# EAGLE design P08R6 (EAGLE 9.6.1)

## Sheet 1 of 2
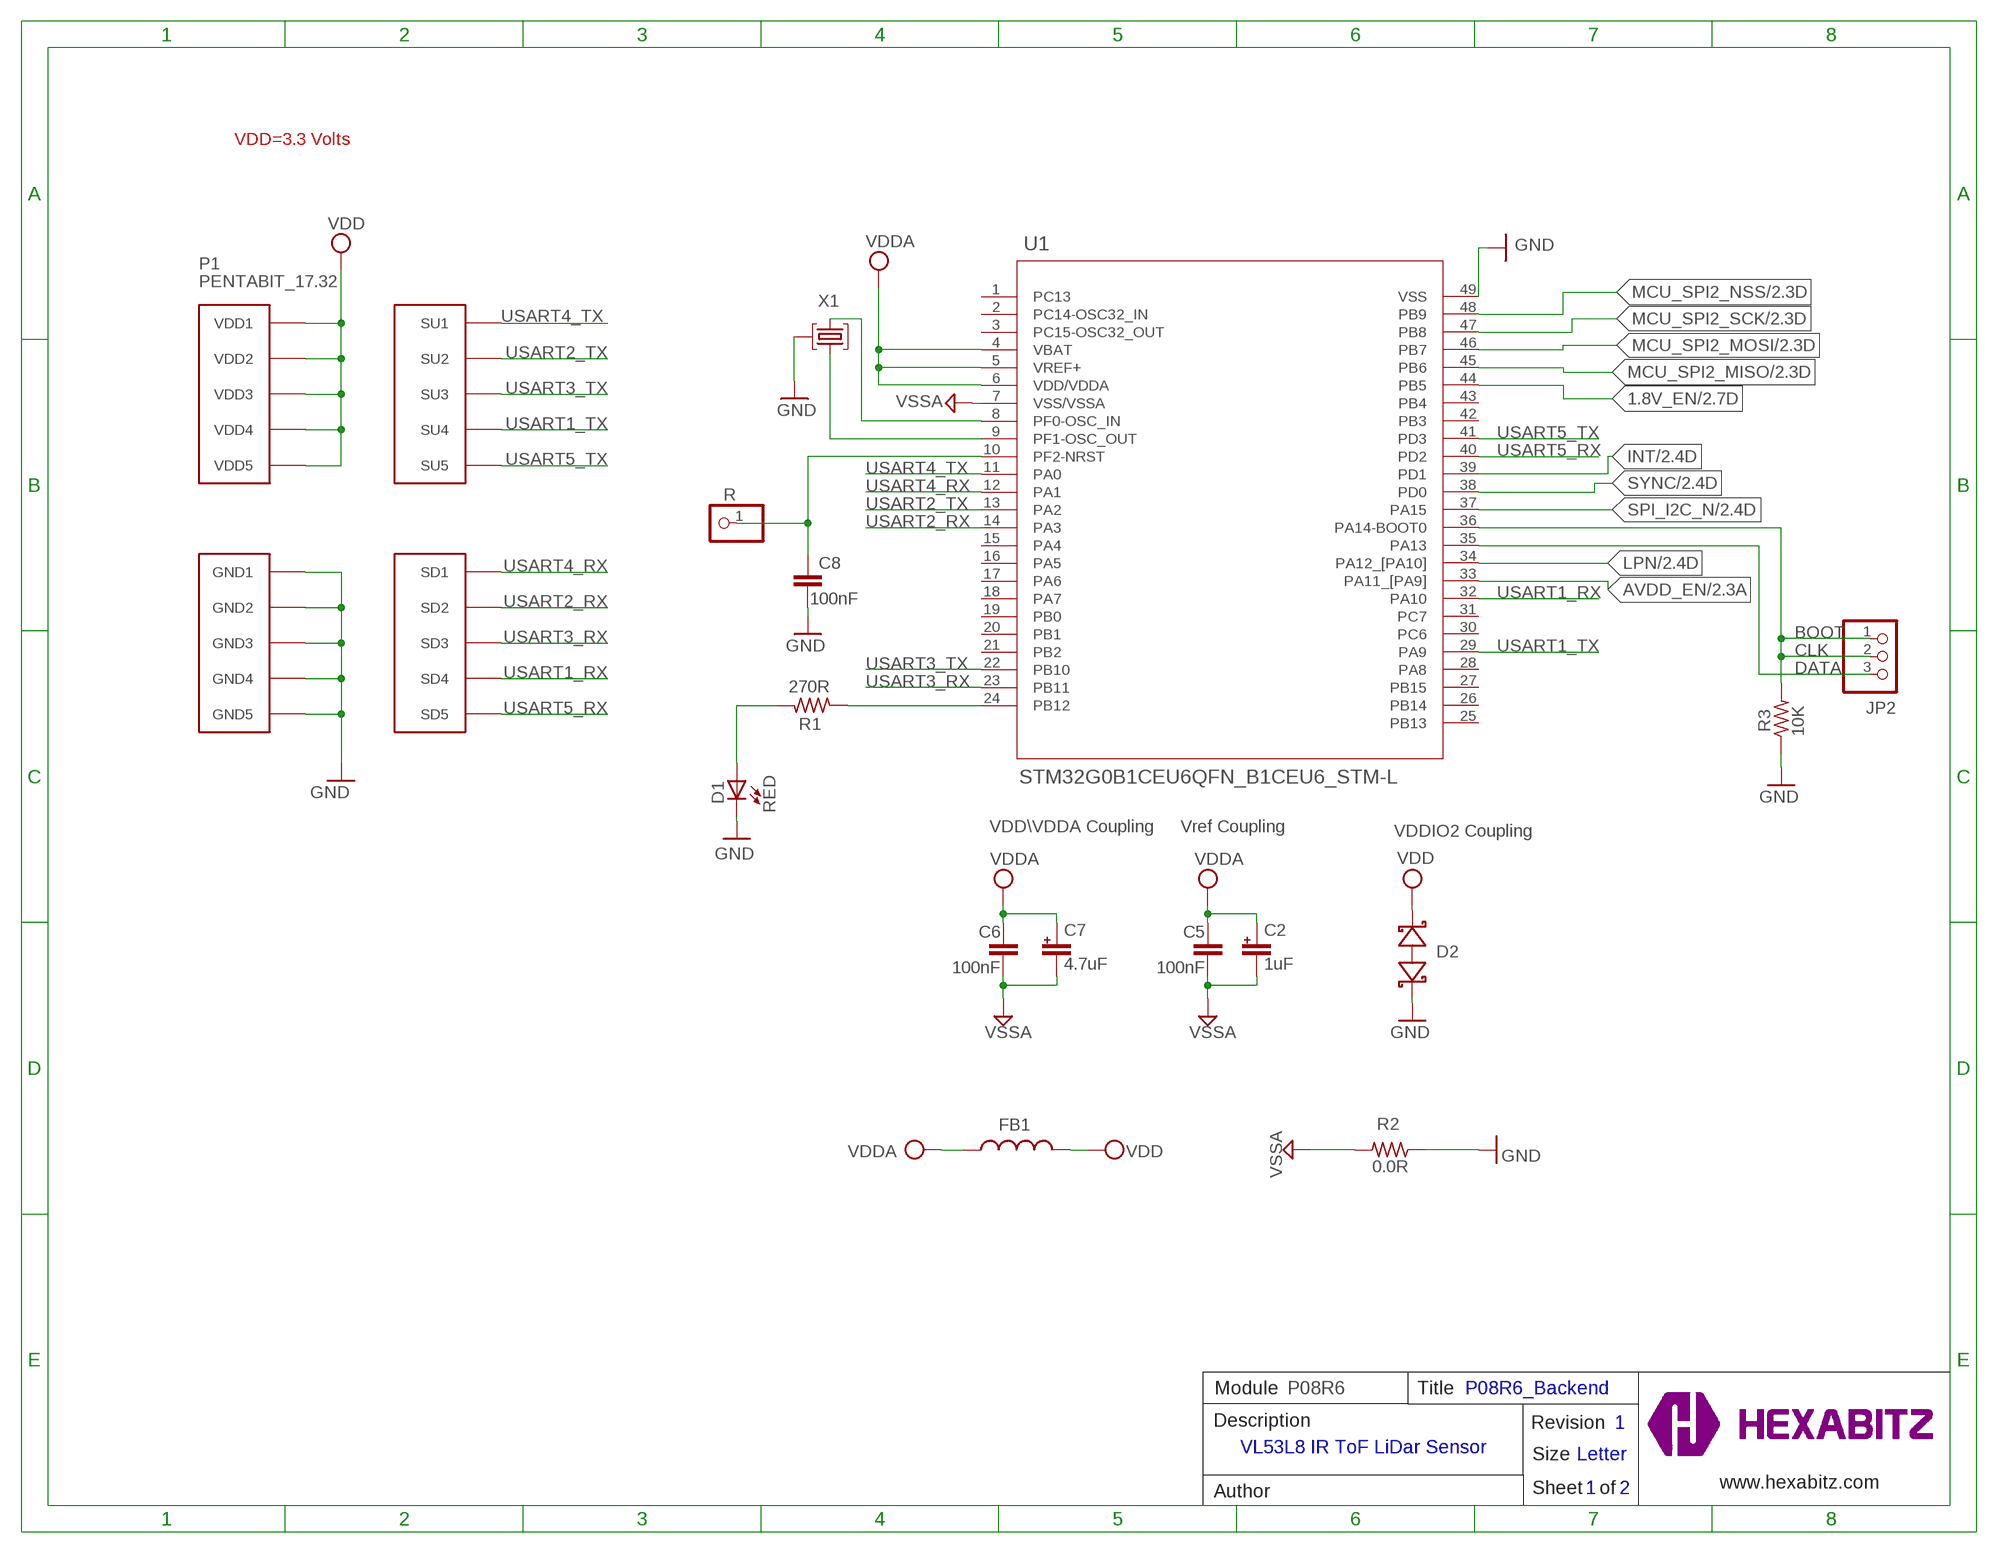
[diagram p0: schematic, sheet 1]

### Parts
C2  1uF  C-0603-POL  [C-0603-POL]
C5  100nF  C-0402  [C-0402]
C6  100nF  C-0402  [C-0402]
C7  4.7uF  C-0603-POL  [C-0603-POL]
C8  100nF  C-0402  [C-0402]
D1  RED  VLMS1300-GS08  [VLMS1300-GS08]
D2  BOURNS_CDSOD323-T03SCBOURNS_CDSOD323-T03SC_0_0  [BOURNS_CDSOD323-T03SC_0]
FB1  FB-TDK_MMZ1608Y300B  FB-0603  [FB-0603]
JP2  PINHD-1X3  [1X03]
P1  PENTABIT_17.32  [PENTABIT_17.32]
R  R  PINHD-1X1  [1X01]
R1  270R  R-0402  [R-0402]
R2  0.0R  R-0402  [R-0402]
R3  10K  R-0402  [R-0402]
TRIMBLE-LOGO1  HEXA-LOGO  [HEXA-LOGO]
U1  STM32G0B1CEU6QFN_B1CEU6_STM-L  [QFN_B1CEU6_STM-L]
X1  XTALL_CSTCE8M00G52  [XTALL_CSTCE8M00G52]

### Nets
1.8V_EN: U1.44(PB5) ; also sheet 2
AVDD_EN: U1.33(PA11_[PA9]) ; also sheet 2
CLK: JP2.1 JP2.2 R3.2 U1.36(PA14-BOOT0)
DATA: JP2.3 U1.35(PA13)
GND: C8.2 D1.C D2.2(C) P1.PAD_PD6(GND1) P1.PAD_PD7(GND2) P1.PAD_PD8(GND3) P1.PAD_PD9(GND4) P1.PAD_PD10(GND5) R2.1 R3.1 U1.49(VSS) X1.P$2 ; also sheet 2
INT: U1.39(PD1) ; also sheet 2
LPN: U1.34(PA12_[PA10]) ; also sheet 2
MCU_SPI2_MISO: U1.45(PB6) ; also sheet 2
MCU_SPI2_MOSI: U1.46(PB7) ; also sheet 2
MCU_SPI2_NSS: U1.48(PB9) ; also sheet 2
MCU_SPI2_SCK: U1.47(PB8) ; also sheet 2
N$3: D1.A R1.2
N$4: C8.1 R.1 U1.10(PF2-NRST)
N$5: U1.9(PF1-OSC_OUT) X1.P$1
N$6: U1.8(PF0-OSC_IN) X1.P$3
N$7: R1.1 U1.24(PB12)
SPI_I2C_N: U1.37(PA15) ; also sheet 2
SYNC: U1.38(PD0) ; also sheet 2
USART1_RX: P1.PAD_PD4(SD4) U1.32(PA10)
USART1_TX: P1.PAD_PU4(SU4) U1.29(PA9)
USART2_RX: P1.PAD_PD2(SD2) U1.14(PA3)
USART2_TX: P1.PAD_PU2(SU2) U1.13(PA2)
USART3_RX: P1.PAD_PD3(SD3) U1.23(PB11)
USART3_TX: P1.PAD_PU3(SU3) U1.22(PB10)
USART4_RX: P1.PAD_PD1(SD1) U1.12(PA1)
USART4_TX: P1.PAD_PU1(SU1) U1.11(PA0)
USART5_RX: P1.PAD_PD5(SD5) U1.40(PD2)
USART5_TX: P1.PAD_PU5(SU5) U1.41(PD3)
VDD: D2.1(A) FB1.2 P1.PAD_PU6(VDD1) P1.PAD_PU7(VDD2) P1.PAD_PU8(VDD3) P1.PAD_PU9(VDD4) P1.PAD_PU10(VDD5) ; also sheet 2
VDDA: C2.1 C5.1 C6.1 C7.1 FB1.1 U1.4(VBAT) U1.5(VREF+) U1.6(VDD/VDDA)
VSSA: C2.2 C5.2 C6.2 C7.2 R2.2 U1.7(VSS/VSSA)
Unconnected: U1.1(PC13) U1.2(PC14-OSC32_IN) U1.3(PC15-OSC32_OUT) U1.15(PA4) U1.16(PA5) U1.17(PA6) U1.18(PA7) U1.19(PB0) U1.20(PB1) U1.21(PB2) U1.25(PB13) U1.26(PB14) U1.27(PB15) U1.28(PA8) U1.30(PC6) U1.31(PC7) U1.42(PB3) U1.43(PB4)

### Notes on the sheet
- VDD=3.3 Volts
- BOOT
- VDD\VDDA Coupling | Vref Coupling | VDDIO2 Coupling
- Module | P08R6 | Title | P08R6_Backend
- Description | Revision | 1
- VL53L8 IR ToF LiDar Sensor
- Size | Letter
- www.hexabitz.com
- Author | Sheet   of | 1 | 2
- C:/Users/Admin/Desktop/logodraft.bmp

## Sheet 2 of 2
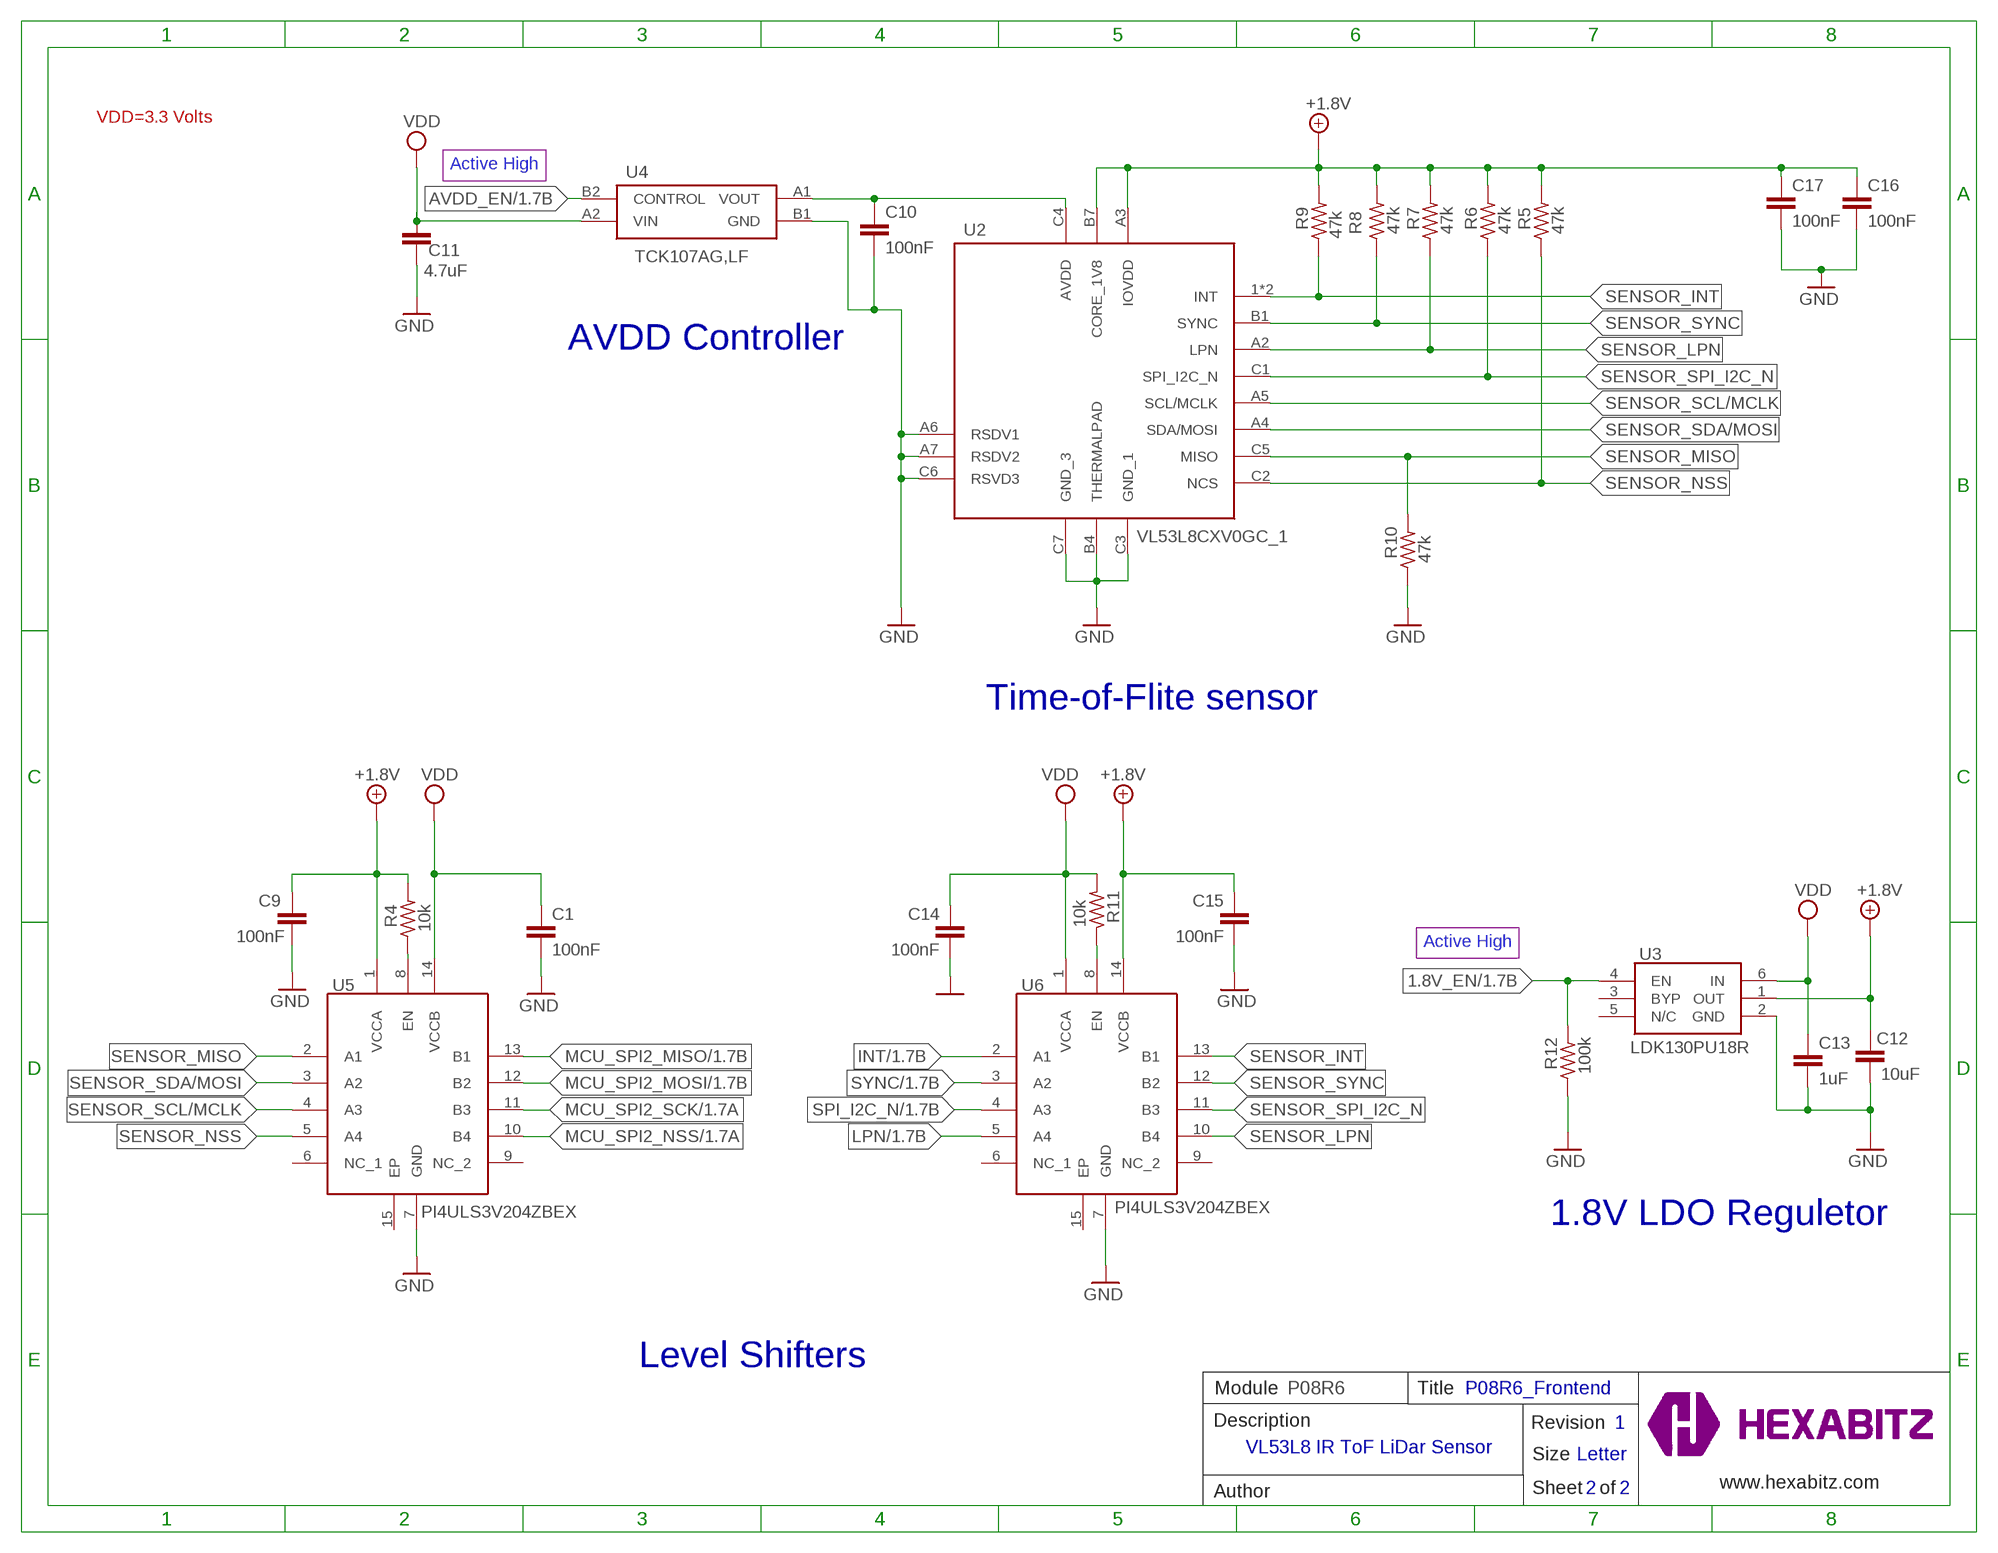
[diagram p1: schematic, sheet 2]

### Parts
C1  100nF  C-0402  [C-0402]
C9  100nF  C-0402  [C-0402]
C10  100nF  C-0402  [C-0402]
C11  4.7uF  C-0603  [C-0603]
C12  10uF  C-0402  [C-0402]
C13  1uF  C-0402  [C-0402]
C14  100nF  C-0402  [C-0402]
C15  100nF  C-0402  [C-0402]
C16  100nF  C-0402  [C-0402]
C17  100nF  C-0402  [C-0402]
R4  10k  R-0402  [R-0402]
R5  47k  R-0402  [R-0402]
R6  47k  R-0402  [R-0402]
R7  47k  R-0402  [R-0402]
R8  47k  R-0402  [R-0402]
R9  47k  R-0402  [R-0402]
R10  47k  R-0402  [R-0402]
R11  10k  R-0402  [R-0402]
R12  100k  R-0402  [R-0402]
U2  VL53L8CXV0GC_1  [VL53L8CXV0GC1]
U3  LDK130PU18R  [LDK130PU18R]
U4  TCK107AG,LF  [BGA4C40P2X2_79X79X59]
U5  PI4ULS3V204ZBEX  [PI4ULS3V204ZBEX]
U6  PI4ULS3V204ZBEX  [PI4ULS3V204ZBEX]

### Nets
1.8V_EN: R12.2 U3.4(EN) ; also sheet 1
+1.8V: C9.1 C12.1 C15.1 C16.1 C17.1 R4.2 R5.2 R6.2 R7.2 R8.2 R9.2 U2.A3(IOVDD) U2.B7(CORE_1V8) U3.1(OUT) U5.1(VCCA) U6.14(VCCB)
AVDD_EN: U4.B2(CONTROL) ; also sheet 1
CONTROLLED_AVDD: C10.1 U2.C4(AVDD) U4.A1(VOUT)
GND: C1.2 C9.2 C10.2 C11.2 C12.2 C13.2 C14.2 C15.2 C16.2 C17.2 R10.1 R12.1 U2.A6(RSDV1) U2.A7(RSDV2) U2.B4(THERMALPAD) U2.C3(GND_1) U2.C6(RSVD3) U2.C7(GND_3) U3.2(GND) U4.B1(GND) U5.7(GND) U6.7(GND) ; also sheet 1
INT: U6.2(A1) ; also sheet 1
LPN: U6.5(A4) ; also sheet 1
MCU_SPI2_MISO: U5.13(B1) ; also sheet 1
MCU_SPI2_MOSI: U5.12(B2) ; also sheet 1
MCU_SPI2_NSS: U5.10(B4) ; also sheet 1
MCU_SPI2_SCK: U5.11(B3) ; also sheet 1
N$1: R4.1 U5.8(EN)
N$2: R11.1 U6.8(EN)
SENSOR_INT: R9.1 U2.1(INT) U2.A1(INT) U6.13(B1)
SENSOR_LPN: R7.1 U2.A2(LPN) U6.10(B4)
SENSOR_MISO: R10.2 U2.C5(MISO) U5.2(A1)
SENSOR_NSS: R5.1 U2.C2(NCS) U5.5(A4)
SENSOR_SCL/MCLK: U2.A5(SCL/MCLK) U5.4(A3)
SENSOR_SDA/MOSI: U2.A4(SDA/MOSI) U5.3(A2)
SENSOR_SPI_I2C_N: R6.1 U2.C1(SPI_I2C_N) U6.11(B3)
SENSOR_SYNC: R8.1 U2.B1(SYNC) U6.12(B2)
SPI_I2C_N: U6.4(A3) ; also sheet 1
SYNC: U6.3(A2) ; also sheet 1
VDD: C1.1 C11.1 C13.1 C14.1 R11.2 U3.6(IN) U4.A2(VIN) U5.14(VCCB) U6.1(VCCA) ; also sheet 1
Unconnected: U3.3(BYP) U3.5(N/C) U5.6(NC_1) U5.9(NC_2) U5.15(EP) U6.6(NC_1) U6.9(NC_2) U6.15(EP)

### Notes on the sheet
- VDD=3.3 Volts
- Active High
- AVDD Controller
- Time-of-Flite sensor
- Active High
- 1.8V LDO Reguletor
- Level Shifters
- Module | P08R6 | Title | P08R6_Frontend
- Description | Revision | 1
- VL53L8 IR ToF LiDar Sensor
- Size | Letter
- www.hexabitz.com
- Author | Sheet   of | 2 | 2

## Library data of the parts
C1 C5 C6 C8-C10 C12-C17 = HEXABITZ_RCLS:C-0402: CAP CER 10% 0402
C2 C7 = HEXABITZ_RCLS:C-0603-POL
C11 = HEXABITZ_RCLS:C-0603: CAP CER 10% X7R 0603
D1 = HEXABITZ_USER_INTERFACE_PARTS:VLMS1300-GS08: Red 0603 130° Clear 54 mcd 2 V Surface Mount ChipLED ; Octopart Url : http://octopart.com/vlms1300-gs08-vishay-21709201; MFN: Vishay; MPN: VLMS1300-GS08; OCTOPART_URL: https://octopart.com/vlms1300-gs08-vishay-21709201?r=sp&s=_gcP4_q8T1SC6PJQPTQ9yA
D2 = HEXABITZ_RCLS:BOURNS_CDSOD323-T03SC: CDSOD323-TxxSC - TVS Diode Series; DESCRIPTION: Dio Tvs Vwm 03V 500W Bidir Sod323 / Tape & Reel - 7" Reel; MFN: Bourns; MPN: CDSOD323-T03SC; OCTOPART_URL: https://octopart.com/cdsod323-t03sc-bourns-10487153?r=sp
FB1 = HEXABITZ_RCLS:FB-0603: Ferrite Beads Multi-Layer 0603; MFN: TDK; MPN: MMZ1608Y300B; OCTOPART_URL: https://octopart.com/mmz1608y300b-tdk-368280?r=sp&s=cd9_2ZEqQ9q9UNBuQgHAiA
JP2 = pinhead:PINHD-1X3: PIN HEADER
P1 = hexabitz_connectors:PENTABIT_?: Hexabitz Pentagon Module Connector Pentagon side length = 17.32mm.
R = HEXABITZ_USER_INTERFACE_PARTS:PINHD-1X1: PIN HEADER; MFN: TE Connectivity; MPN: 87227-1; OCTOPART_URL: https://octopart.com/87227-1-te+connectivity-39512052?r=sp
R1 R3-R12 = HEXABITZ_RCLS:R-0402: Thick Film Resistors - SMD 0603
R2 = HEXABITZ_RCLS:R-0402: Thick Film Resistors - SMD 0603; MFN: Yageo; MPN: RC0603JR-070RL; OCTOPART_URL: https://octopart.com/rc0603jr-070rl-yageo-1241539?r=sp&s=X2NteqRjRNWrnx42Y0aliA; RESISTANCE: 0.0 Ohm
TRIMBLE-LOGO1 = HEXABITZ_USER_INTERFACE_PARTS:HEXA-LOGO: Trimble-Logo
U1 = HEXABITZ_ICs:STM32G0B1CEU6; COPYRIGHT: Copyright (C) 2021 Ultra Librarian. All rights reserved.; MANUFACTURER_PART_NUMBER: STM32G0B1CEU6; MFR_NAME: STMicroelectronics
U2 = HEXABITZ_ICs:VL53L8CXV0GC_1: Low-power high-performance 8x8 multizone Time-of-Flight sensor 940 nm, 6.4x3.0x1.75 mm, -30 to 85C Source: Datasheet <https://www.st.com/resource/en/datasheet/vl53l8cx.pdf>; ARROW_PART_NUMBER: VL53L8CXV0GC/1; ARROW_PRICE-STOCK: https://www.arrow.com/en/products/vl53l8cxv0gc1/stmicroelectronics?region=europe; DESCRIPTION: Low-power high-performance 8x8 multizone Time-of-Flight sensor 940 nm, 6.4x3.0x1.75 mm, -30 to 85C; HEIGHT: 1.8mm; MANUFACTURER_NAME: STMicroelectronics; MANUFACTURER_PART_NUMBER: VL53L8CXV0GC/1; MOUSER_PART_NUMBER: 511-VL53L8CXV0GC/1; MOUSER_PRICE-STOCK: https://www.mouser.co.uk/ProductDetail/STMicroelectronics/VL53L8CXV0GC-1?qs=T%252BzbugeAwjhc9idkQC%252BF8g%3D%3D
U3 = HEXABITZ_ICs:LDK130PU18R: LDO Voltage Regulators 300mA current very low noise LDO Source: Datasheet <http://www.st.com/web/en/resource/technical/document/datasheet/DM00076097.pdf>; DESCRIPTION: LDO Voltage Regulators 300mA current very low noise LDO; HEIGHT: 0.5mm; MANUFACTURER_NAME: STMicroelectronics; MANUFACTURER_PART_NUMBER: LDK130PU18R; MOUSER_PART_NUMBER: 511-LDK130PU18R; MOUSER_PRICE-STOCK: https://www.mouser.co.uk/ProductDetail/STMicroelectronics/LDK130PU18R?qs=Us3gTOFd0HosQ%2FeNbz5XPw%3D%3D
U4 = HEXABITZ_ICs:TCK107AG,LF: Power Switch ICs - Power Distribution Load Switch IC Source: Datasheet <https://toshiba.semicon-storage.com/info/docget.jsp?did=30131&prodName=TCK106AG>; DESCRIPTION: Power Switch ICs - Power Distribution Load Switch IC; HEIGHT: 0.59mm; MANUFACTURER_NAME: Toshiba; MANUFACTURER_PART_NUMBER: TCK107AG,LF; MOUSER_PART_NUMBER: 757-TCK107AGLF; MOUSER_PRICE-STOCK: https://www.mouser.co.uk/ProductDetail/Toshiba/TCK107AGLF?qs=lX6dEUlT%252Bgfv0djoZbXdYw%3D%3D
U5 U6 = HEXABITZ_ICs:PI4ULS3V204ZBEX: Voltage Level Translator Bidirectional 4 Circuit 1 Channel 2Mbps, 24Mbps 14-TQFN (3.5x3.5) Source: Datasheet <https://www.diodes.com/assets/Datasheets/PI4ULS3V204.pdf>; DESCRIPTION: Voltage Level Translator Bidirectional 4 Circuit 1 Channel 2Mbps, 24Mbps 14-TQFN (3.5x3.5); HEIGHT: 0.9mm; MANUFACTURER_NAME: Diodes Incorporated; MANUFACTURER_PART_NUMBER: PI4ULS3V204ZBEX; MOUSER_PART_NUMBER: 729-PI4ULS3V204ZBEX; MOUSER_PRICE-STOCK: https://www.mouser.co.uk/ProductDetail/Diodes-Incorporated/PI4ULS3V204ZBEX?qs=AQlKX63v8RsT3Gro83mlXA%3D%3D
X1 = HEXABITZ_RCLS:XTALL_CSTCE8M00G52: MURATA CSTCE8M00G52-R0 RESONATOR, SMD, 8MHZ ; Octopart Url : https://octopart.com/cstce8m00g52-r0-murata-7145559; MFN: Murata; MPN: CSTCE8M00G52Z-R0; OCTOPART_URL: https://octopart.com/cstce8m00g52z-r0-murata-17755941?r=sp&s=JDnNJnrHQhyS8Zk4ofFWXw

## Board
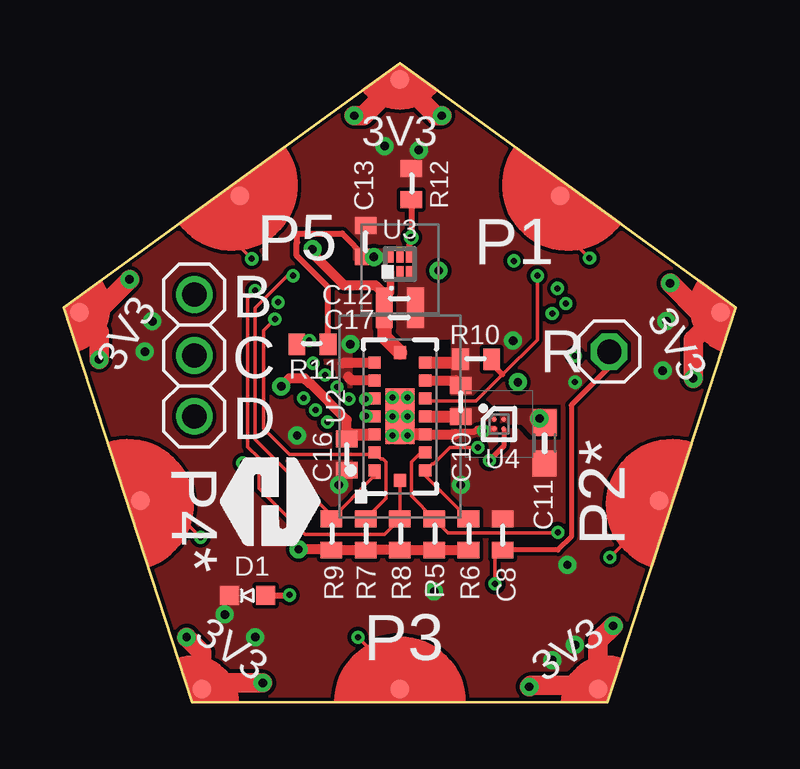
[diagram p2: board, top side]
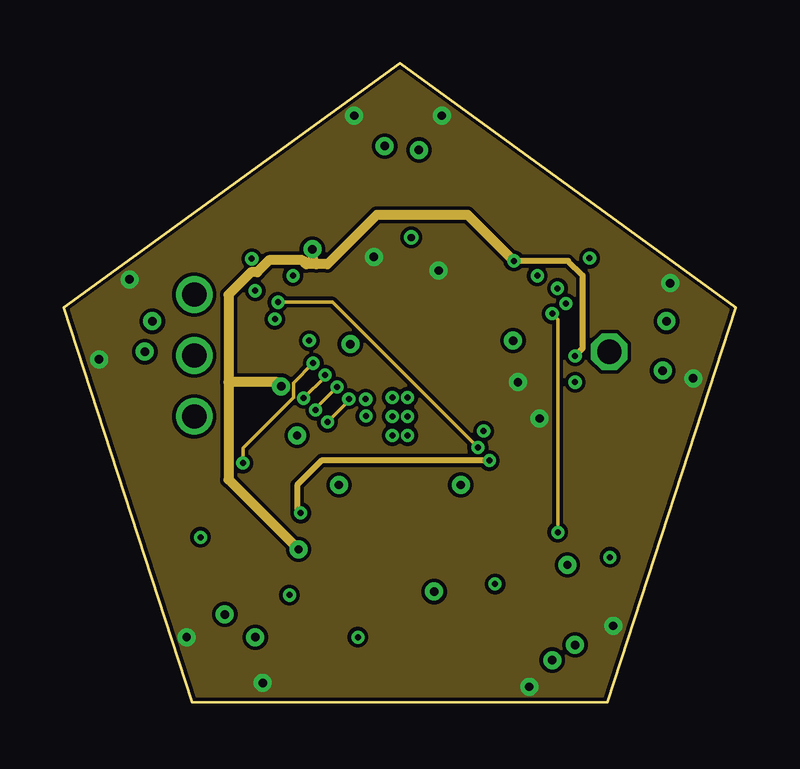
[diagram p3: board, inner layer Route2]
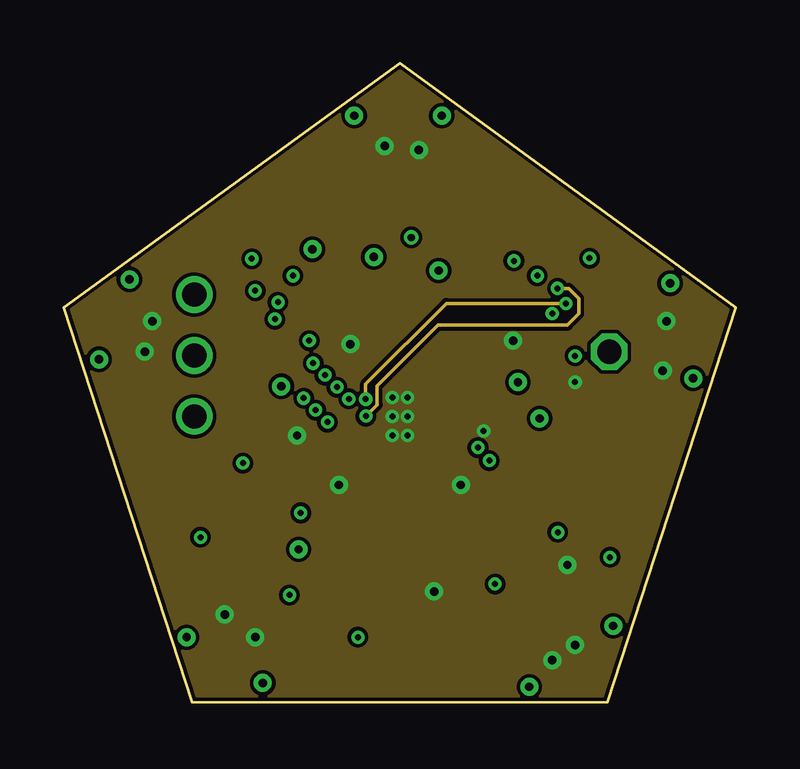
[diagram p4: board, inner layer Route15]
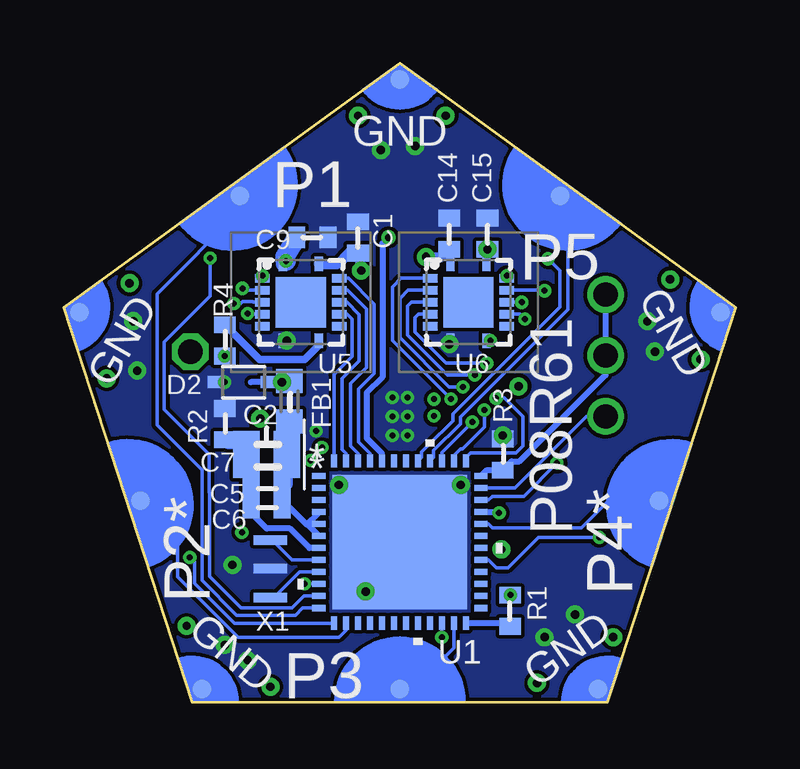
[diagram p5: board, bottom side, seen from below]

Size 28.02 x 26.65 mm. Coordinates in mm from the lower left corner, seen from the top.
Copper layers (1*2+15*16): Top 0.035mm / dielectric 0.175mm / Route2 0.035mm / dielectric 1.11mm / Route15 0.035mm / dielectric 0.175mm / Bottom 0.035mm
Design rules "4_layer *": minimum track width 6mil, minimum drill 0.2mm, track to track 6mil, track to pad 6mil, pad to pad 6mil, via to via 6mil, smd to smd 0mil, copper to edge 0.15mm, drill to drill 6mil, minimum pad ring 6mil, minimum via ring 3mil, stop-mask expansion 2mil, vias tented up to drill 15mil, thermal gap 10mil

### Footprints (pad centres in the part's own frame; a part is rotated, then mirrored left to right if it is on the bottom)
C-0402 = smd 0.7 x 0.9: 1 -0.65,0; 2 0.65,0
C-0603-POL = smd 1.1 x 1: 1 -0.85,0; 2 0.85,0
C-0603 = smd 1.1 x 1: 1 -0.85,0; 2 0.85,0
VLMS1300-GS08 = smd 0.8 x 0.8: A 0,0.75; C 0,-0.75
BOURNS_CDSOD323-T03SC_0 = smd 0.8 x 0.5: 1 -1.1,0; 2 1.1,0
FB-0603 = smd 1 x 1.1: 1 -0.85,0; 2 0.85,0
1X03 = drill 1.016: 1 -2.54,0; 2 0,0; 3 2.54,0
PENTABIT_17.32 = smd 0.8 x 0.8 bottom: PAD_PD1 6.68,9.2; PAD_PD2 10.81,-3.51; PAD_PD3 0,-11.37; PAD_PD4 -10.81,-3.51; PAD_PD5 -6.68,9.2; PAD_PD6 0,14.05; PAD_PD7 13.36,4.34; PAD_PD8 8.26,-11.37; PAD_PD9 -8.26,-11.37; PAD_PD10 -13.36,4.34 | smd 0.8 x 0.8: PAD_PU1 6.68,9.2; PAD_PU2 10.81,-3.51; PAD_PU3 0,-11.37; PAD_PU4 -10.81,-3.51; PAD_PU5 -6.68,9.2; PAD_PU6 0,14.05; PAD_PU7 13.36,4.34; PAD_PU8 8.26,-11.37; PAD_PU9 -8.26,-11.37; PAD_PU10 -13.36,4.34
1X01 = drill 1.016 octagon: 1 0,0
R-0402 = smd 0.7 x 0.9: 1 -0.65,0; 2 0.65,0
QFN_B1CEU6_STM-L = smd 0.55 x 0.254: 1 -3.38,2.751; 2 -3.38,2.251; 3 -3.38,1.75; 4 -3.38,1.25; 5 -3.38,0.75; 6 -3.38,0.25; 7 -3.38,-0.25; 8 -3.38,-0.75; 9 -3.38,-1.25; 10 -3.38,-1.75; 11 -3.38,-2.251; 12 -3.38,-2.751; 25 3.38,-2.751; 26 3.38,-2.251; 27 3.38,-1.75; 28 3.38,-1.25; 29 3.38,-0.75; 30 3.38,-0.25; 31 3.38,0.25; 32 3.38,0.75; 33 3.38,1.25; 34 3.38,1.75; 35 3.38,2.251; 36 3.38,2.751 | smd 0.254 x 0.55: 13 -2.751,-3.38; 14 -2.251,-3.38; 15 -1.75,-3.38; 16 -1.25,-3.38; 17 -0.75,-3.38; 18 -0.25,-3.38; 19 0.25,-3.38; 20 0.75,-3.38; 21 1.25,-3.38; 22 1.75,-3.38; 23 2.251,-3.38; 24 2.751,-3.38; 37 2.751,3.38; 38 2.251,3.38; 39 1.75,3.38; 40 1.25,3.38; 41 0.75,3.38; 42 0.25,3.38; 43 -0.25,3.38; 44 -0.75,3.38; 45 -1.25,3.38; 46 -1.75,3.38; 47 -2.251,3.38; 48 -2.751,3.38 | smd 5.6 x 5.6: 49 0,0
VL53L8CXV0GC1 = smd 0.2 x 0.1: 1 -0.9,-2.55 | smd 0.515 x 0.5: A1 -1.058,-2.25; A2 -1.058,-1.5; A3 -1.058,-0.75; A4 -1.058,0; A5 -1.058,0.75; A6 -1.058,1.5; A7 -1.058,2.25; C1 1.058,-2.25; C2 1.058,-1.5; C3 1.058,-0.75; C4 1.058,0; C5 1.058,0.75; C6 1.058,1.5; C7 1.058,2.25 | smd 0.5 x 0.535: B1 0,-2.668; B7 0,2.668 | smd 1.2 x 2.316: B4 0,0
LDK130PU18R = smd 0.28 x 0.53: 1 -0.4,-0.34; 2 0,-0.34; 3 0.4,-0.34; 4 0.4,0.34; 5 0,0.34; 6 -0.4,0.34
BGA4C40P2X2_79X79X59 = smd 0.208 x 0.208: A1 -0.2,0.2; A2 0.2,0.2; B1 -0.2,-0.2; B2 0.2,-0.2
PI4ULS3V204ZBEX = smd 0.6 x 0.35: 1 -1.6,-0.75; 7 1.6,-0.75; 8 1.6,0.75; 14 -1.6,0.75 | smd 0.35 x 0.6: 2 -1,-1.6; 3 -0.5,-1.6; 4 0,-1.6; 5 0.5,-1.6; 6 1,-1.6; 9 1,1.6; 10 0.5,1.6; 11 0,1.6; 12 -0.5,1.6; 13 -1,1.6 | smd 2.1 x 2.1: 15 0,0
XTALL_CSTCE8M00G52 = smd 1.4 x 0.4: P$1 0,1.2; P$2 0,0; P$3 0,-1.2

### Placement (x,y rotation side)
C1  15.76,19.38 90 bottom
C2  19.57,10.81 180 bottom
C5  19.57,8.9 180 bottom
C6  19.57,8.11 180 bottom
C7  19.57,9.86 180 bottom
C8  18.3,7 90 top
C9  17.66,19.38 0 bottom
C10  16.55,12.55 90 top
C11  20.04,10.81 270 top
C12  14.01,16.84 0 top
C13  12.58,19.22 90 top
C14  11.95,19.54 90 bottom
C15  10.36,19.54 90 bottom
C16  11.79,10.33 270 top
C17  14.01,16.05 0 top
D1  7.66,4.46 270 top
D2  20.52,13.35 180 bottom
FB1  18.61,12.55 90 bottom
JP2  5.44,14.46 270 top
P1  14.01,11.92 0 top
R  22.74,14.62 0 top
R1  9.41,3.82 90 bottom
R2  21.31,11.6 270 bottom
R3  9.72,10.33 270 bottom
R4  21.31,15.09 270 bottom
R5  15.44,7 270 top
R6  16.87,7 270 top
R7  12.58,7 270 top
R8  14.01,7 270 top
R9  11.15,7 270 top
R10  17.18,14.3 0 top
R11  10.36,14.94 0 top
R12  14.49,21.6 270 top
TRIMBLE-LOGO1  8.61,6.52 0 top
U1  14.01,6.68 0 bottom
U2  14.01,11.92 0 top
U3  14.01,18.27 0 top
U4  18.14,11.6 0 top
U5  18.14,16.68 270 bottom
U6  11.15,16.68 270 bottom
X1  19.41,5.57 180 bottom

### Tracks (layer width: path | path; a pad name or v marks a point on that pad's centre or on a via)
1.8V_EN  (via drill 0.3 pad 0.6)
  Top 0.254: U3.4 14.41,19.07 14.43,19.09 14.43,19.32 v14.49,19.38 R12.2
  Bottom 0.254: U1.44 14.76,10.38 15.38,11 15.38,12.91 14.74,13.55 14.74,19.13 v14.49,19.38
+1.8V  (via drill 0.25 pad 0.55, 0.35 pad 0.75)
  Top 0.305: U3.1 13.61,17.09 13.45,16.93 C12.1 C17.1
  Top 0.406: 13.45,16.93 12.98,17.39 11.67,17.39 10.36,18.71 C15.1 | R6.2 R5.2 R8.2 R7.2 R9.2 11.12,6.38 v9.78,6.38 | C16.1 11.79,11.78 10.26,13.31 10.24,13.31 10.04,13.51 9.4,13.51 v9.06,13.18
  Top 0.508: U2.A3 11.97,11.17 C16.1
  Top 0.61: U2.B7 13.36,15.24 C17.1
  Route2 0.254: R4.2 21.63,14.76 21.63,17.79 21.02,18.41 v18.76,18.41
  Route2 0.406: 10.52,18.27 10.99,18.27 13.05,20.33 16.84,20.33 v18.76,18.41 | 10.52,18.27 10.1,18.27 9.95,18.43 8.56,18.43 8.06,17.94 7.8,17.94 6.87,17 6.87,13.35 | 6.87,13.35 6.87,9.29 v9.78,6.38 | v9.06,13.18 8.89,13.35 6.87,13.35 | C15.1 10.36,18.43 10.52,18.27
  Bottom 0.152: C15.1 10.4,18.85 U6.14
  Bottom 0.61: v18.76,18.41 U5.1
  Bottom 0.813: v18.76,18.41 18.79,18.43 18.79,18.59 C9.1
  other vias: 10.36,18.89 21.31,14.45
AVDD_EN  (via drill 0.25 pad 0.55)
  Top 0.203: U4.B2 18.34,10.68 v17.74,10.08
  Route2 0.254: v17.74,10.08 10.74,10.08 9.72,9.06 9.72,8.05 v9.87,7.9
  Bottom 0.254: U1.33 9.91,7.93 v9.87,7.9
CLK
  Bottom 0.254: JP2.1 JP2.2 5.44,13.64 9.03,10.05 9.36,10.05 R3.2 10.38,9.68 U1.36
CONTROLLED_AVDD
  Top 0.508: U2.C4 16.54,11.92 C10.1
  pour Top (no thermals): 14.8,12.4 17.5,12.4 17.98,11.92 17.98,11.6 14.8,11.6
DATA
  Bottom 0.152: U1.35 9.22,8.93 6.23,11.92 JP2.3
GND  (via drill 0.25 pad 0.55, 0.35 pad 0.75)
  Top 0.152: U2.B4 v13.69,11.92
  Top 0.254: U4.B1 17.24,11.4 17.12,11.28 16.54,11.28 16.39,11.13 16.35,11.17
  Top 0.406: U2.A7 12.93,14.14 11.63,14.14 | U2.A6 12,13.42 11.85,13.57 | 16.58,14.17 16.71,14.3 | U2.C6 16.34,13.42 C10.2 | U2.C3 16.35,11.17
  Top 0.508: U2.C3 14.37,11.17 v14.33,11.13 | U2.C7 16.4,14.17 R10.1
  other vias: 13.69,12.71 14.33,12.71 14.33,11.92 13.69,11.13 3.69,15.89 3.37,14.62 15.44,4.62 7.98,2.71 6.71,3.66 20.36,1.76 21.31,2.39 21,5.73 25.12,15.89 24.96,13.82 14.8,23.03 13.38,23.19 11.95,14.94 11.47,9.06 9.72,11.13 18.73,15.08 16.55,9.06 21.31,13.35 17.5,11.31
  pour Top (rank 3, no thermals): 29.41,27.8 -3.29,27.8 -3.45,27.64 -3.45,-1.57 -2.98,-2.05 30.2,-2.05 31.79,-0.46 31.79,27.8
  pour Route15 (no thermals): 29.41,27.8 -3.29,27.8 -3.45,27.64 -3.45,-1.57 -2.98,-2.05 30.2,-2.05 31.79,-0.46 31.79,27.8
  pour Bottom (no thermals): 29.41,27.8 -3.29,27.8 -3.45,27.64 -3.45,-1.57 -2.98,-2.05 30.2,-2.05 31.79,-0.46 31.79,27.8
  cutout Top (no thermals): 16.07,15.09 16.07,8.75 12.11,8.75 12.11,15.09
INT  (via drill 0.25 pad 0.55)
  Route2 0.152: v10.99,11.69 11.88,12.58 v11.88,12.65
  Bottom 0.152: U1.39 12.26,10.42 v10.99,11.69 | v11.88,12.65 14.33,15.09 14.33,17.32 13.96,17.68 U6.2
LPN  (via drill 0.25 pad 0.55)
  Route2 0.152: v7.46,9.98 7.46,10.61 9.57,12.72 9.57,13.32 v10.39,14.14
  Bottom 0.152: U1.34 10.31,8.43 10.15,8.59 8.85,8.59 v7.46,9.98 | v10.39,14.14 10.67,14.14 10.68,14.15 12.09,14.15 13.38,15.44 13.38,16.05 13.24,16.18 U6.5
MCU_SPI2_MISO
  Bottom 0.152: U5.13 16.16,17.68 15.09,16.62 15.09,13.7 15.74,13.06 15.74,10.86 15.26,10.38 U1.45
MCU_SPI2_MOSI
  Bottom 0.152: U5.12 16.19,17.18 15.4,16.39 15.4,13.96 16.08,13.28 16.08,10.7 15.76,10.38 U1.46
MCU_SPI2_NSS
  Bottom 0.152: U5.10 16.21,16.18 16.01,15.98 16.01,14.42 16.76,13.67 U1.48
MCU_SPI2_SCK
  Bottom 0.152: U5.11 16.22,16.68 15.7,16.17 15.7,14.22 16.42,13.51 16.42,10.54 16.26,10.38 U1.47
N$1
  Bottom 0.305: U5.8 17.39,14.89 17.98,14.3 19.87,14.3 R4.1
N$2  (via drill 0.25 pad 0.55)
  Top 0.254: R11.1 9.86,15.08 v10.23,15.08
  Bottom 0.254: v10.23,15.08 U6.8
N$3  (via drill 0.25 pad 0.55)
  Top 0.254: D1.A 9.39,4.46 R1.2
  Bottom 0.508: R1.2 9.39,4.46
  other vias: 9.41,4.47
N$4  (via drill 0.25 pad 0.55)
  Top 0.152: C8.1 17.98,6.03 v17.98,4.93
  Top 0.203: R.1 22.74,13.98 21.15,12.4 21.15,6.89 20.61,6.35 C8.1
  Bottom 0.152: v17.98,4.93 U1.10
N$5
  Bottom 0.152: X1.P$1 19.26,4.37 18.19,5.44 U1.9
N$6
  Bottom 0.152: U1.8 18.5,5.93 19.34,6.77 X1.P$3
N$7
  Bottom 0.254: R1.1 9.53,3.3 U1.24
SENSOR_INT  (via drill 0.25 pad 0.55)
  Top 0.152: v9.55,17.79 9.32,17.79 7.98,16.44 7.98,10.97 11.15,7.79 R9.1 12.87,9.37 U2.1 13.11,9.51 U2.A1
  Bottom 0.152: v9.55,17.79 U6.13
SENSOR_LPN  (via drill 0.25 pad 0.55)
  Top 0.152: R7.1 13.44,8.51 13.44,10.01 13.3,10.15 13.22,10.15 U2.A2 12.87,10.33 9.41,10.33 8.32,11.42 8.32,15.5 v8.8,15.98
  Bottom 0.152: v8.8,15.98 9,16.18 9.14,16.18 U6.10
SENSOR_MISO  (via drill 0.25 pad 0.55)
  Top 0.152: U2.C5 15.18,12.55 17.18,12.55 18.3,13.67 19.74,15.11 v19.74,17.79
  Top 0.2: R10.2 17.84,14.13 18.3,13.67
  Bottom 0.152: v19.74,17.79 U5.2
SENSOR_NSS  (via drill 0.25 pad 0.55)
  Top 0.152: U2.C2 14.89,10.42 14.49,10.02 14.49,9.62 14.49,9.61 14.49,8.6 R5.1 16.02,7.07 20.58,7.07 v20.6,7.09
  Route2 0.152: v20.6,7.09 20.6,15.97 v20.36,16.21
  Bottom 0.152: v20.36,16.21 20.34,16.18 U5.5
SENSOR_SCL/MCLK  (via drill 0.25 pad 0.55)
  Top 0.152: U2.A5 12.92,12.64 v12.58,12.64
  Route15 0.152: v20.94,16.62 20.87,16.62 20.86,16.64 15.95,16.64 12.58,13.28 v12.58,12.64
  Bottom 0.152: v20.94,16.62 20.66,16.62 20.57,16.71 20.15,16.71 20.12,16.68 U5.4
SENSOR_SDA/MOSI  (via drill 0.25 pad 0.55)
  Top 0.152: U2.A4 12.61,11.92 v12.59,11.94
  Route15 0.152: v20.58,17.26 21.05,17.26 21.47,16.84 21.47,16.21 21,15.73 15.6,15.73 13.06,13.19 13.06,12.4 v12.59,11.94
  Bottom 0.152: U5.3 20.5,17.18 v20.58,17.26
SENSOR_SPI_I2C_N  (via drill 0.25 pad 0.55)
  Top 0.152: R6.1 15.07,9.45 U2.C1 15.34,9.94 15.42,9.94 16.1,10.62 v17.26,10.62
  Route2 0.152: v17.26,10.62 11.21,16.68 v8.93,16.68
  Bottom 0.152: v8.93,16.68 U6.11
SENSOR_SYNC  (via drill 0.25 pad 0.55)
  Top 0.152: U2.B1 R8.1 13.36,7 10.06,7 8.14,8.92 8.14,10.18 7.66,10.66 7.66,16.84 v7.98,17.16
  Bottom 0.152: U6.12 9.14,17.18 9.14,17.19 8,17.19 v7.98,17.16
SPI_I2C_N  (via drill 0.25 pad 0.55)
  Route2 0.152: v10,12.68 10.89,13.57 v10.89,13.64
  Bottom 0.152: v10,12.68 9.64,12.68 8.89,11.92 8.89,10.7 9.18,10.4 11.07,10.4 11.26,10.22 U1.37 | v10.89,13.64 11.17,13.64 11.18,13.65 12.02,13.65 13.69,15.32 13.69,16.52 13.53,16.68 U6.4
SYNC  (via drill 0.25 pad 0.55)
  Route2 0.152: v11.39,13.15 10.49,12.26 v10.49,12.18
  Bottom 0.152: U1.38 11.76,10.29 11.48,10.56 11.4,10.56 10.49,11.48 v10.49,12.18 | v11.39,13.15 11.67,13.15 11.96,13.15 14.01,15.21 14.01,16.84 13.67,17.18 U6.3
USART1_RX
  Bottom 0.152: U1.32 10.31,7.43 10.15,7.27 6.43,7.27 5.3,8.41 P1.PAD_PD4
USART1_TX  (via drill 0.25 pad 0.55)
  Top 0.152: v5.7,6.88 4.16,8.41 P1.PAD_PU4
  Bottom 0.152: U1.29 10.31,5.93 10,5.61 9.5,5.61 8.24,6.88 v5.7,6.88
USART2_RX
  Bottom 0.152: P1.PAD_PD2 23.27,6.86 23.27,5.24 20.75,2.71 16.55,2.71 16.26,3 U1.14
USART2_TX  (via drill 0.25 pad 0.55)
  Top 0.152: v22.77,6.05 24.82,8.1 P1.PAD_PU2
  Bottom 0.152: v22.77,6.05 22.57,5.85 22.57,4.97 20.9,3.3 U1.13
USART3_RX
  Bottom 0.152: U1.23 11.76,2.26 13.47,0.55 P1.PAD_PD3
USART3_TX  (via drill 0.25 pad 0.55)
  Top 0.152: v12.26,2.71 14.01,0.97 P1.PAD_PU3
  Bottom 0.152: U1.22 v12.26,2.72 v12.26,2.71
USART4_RX
  Bottom 0.152: U1.12 18.08,3.93 18.37,3.64 20.81,3.64 22.27,5.09 22.27,9.7 24.14,11.57 24.14,17.03 20.68,20.49 20.68,21.11 P1.PAD_PD1
USART4_TX  (via drill 0.25 pad 0.55)
  Top 0.152: P1.PAD_PU1 20.69,19.75 v21.92,18.52
  Bottom 0.152: U1.11 18.01,4.43 18.5,3.94 20.64,3.94 21.95,5.25 21.95,8.75 21.96,8.76 21.96,10.33 23.84,12.21 23.84,15.01 21.92,16.93 v21.92,18.52
USART5_RX
  Bottom 0.152: P1.PAD_PD5 7.01,20.8 7.01,16.38 11.49,11.89 11.49,11.61 12.62,10.49 12.62,10.21 U1.40
USART5_TX  (via drill 0.25 pad 0.55)
  Top 0.152: v7.83,18.49 7.33,19 P1.PAD_PU5
  Bottom 0.152: v7.83,18.49 7.34,18 7.34,16.48 11.8,12.02 11.8,11.74 12.82,10.72 13.12,10.43 13.12,10.21 U1.41
VDD  (via drill 0.35 pad 0.75)
  Top 0.254: R11.2 11.01,17.31 9.7,18.62 9.7,19.16 9.72,19.18 9.72,19.54 10.08,19.54 10.09,19.54 11.61,19.54 C13.1
  Top 0.61: C13.1 v12.92,18.57
  Top 0.813: P1.PAD_PU7 27.37,15.91 | 14.01,25.9 P1.PAD_PU6 | v2.74,17.63 1.36,16.26 P1.PAD_PU10 0.69,16.26 0.71,16.24 0.73,16.18 1.47,15.44 v1.47,14.3 | v8.29,0.81 6.01,0.81 5.81,0.61 | 5.81,0.61 5.79,0.61 | 5.81,0.61 P1.PAD_PU9 5.75,2.08 v5.12,2.71 | v19.41,0.65 19.47,0.71 22.11,0.71 P1.PAD_PU8 22.27,2.56 v22.9,3.19 | P1.PAD_PU7 26.23,15.12 v26.23,13.51 | P1.PAD_PU7 26.5,16.26 v25.28,17.48 | P1.PAD_PU6 12.5,24.46 v12.11,24.46 | P1.PAD_PU6 15.52,24.46 v15.76,24.46 | C11.1 20.01,11.66 v19.83,11.84
  Bottom 0.254: v18.93,13.35 18.88,13.4 FB1.2 19.36,13.4 D2.1 20.22,13.35 | U6.1 11.9,18.85 C14.1 | C1.1 15.76,18.13 v15.63,18
  Bottom 0.406: U5.14 16.59,18.28 16.14,18.73 C1.1 | v12.92,18.57 12.26,18.57 C14.1
  Bottom 0.813: 18.67,13.35 FB1.2
  pour Top (no thermals): 13.69,18.91 13.69,18.43 12.11,18.43 12.11,18.91
  pour Top (rank 2, no thermals): 18.14,11.6 18.14,12.24 20.52,12.24 20.52,11.13 19.57,11.13 19.09,11.6
  pour Route2 (no thermals): 29.41,27.8 -3.29,27.8 -3.45,27.64 -3.45,-1.57 -2.98,-2.05 30.2,-2.05 31.79,-0.46 31.79,27.8
VDDA
  Bottom 0.152: U1.6 17.42,6.93
  Bottom 0.254: C6.1 18.6,8.11 17.92,7.43 | 17.92,7.43 17.89,7.4 17.39,7.91 U1.4 | U1.5 17.89,7.43 | U1.6 17.89,7.43 | 17.89,7.43 17.92,7.43
  Bottom 0.508: C6.1 C5.1 18.72,9.1 C7.1 C2.1 18.72,11.6 FB1.1
VSSA
  Bottom 0.254: U1.7 17.79,6.43 17.79,6.45 18.59,7.25 19.57,7.25 20.22,7.9 C6.2
  Bottom 0.508: C6.2 C5.2 20.22,9.66 C7.2 C2.2 21.17,10.81 R2.2

### Text on the board
tPlace: 3V3 | P5 | P1 | . | B | 3V3 | 3V3 | C | D | P2* | P4* | . | P3 | 3V3 | 3V3
bPlace: GND | P1 | P5 | GND | GND | * | P4* | P2* | GND | GND | P3
bNames: P08R61 | U1